# Altium schematic sheet RS485.SchDoc
size A4
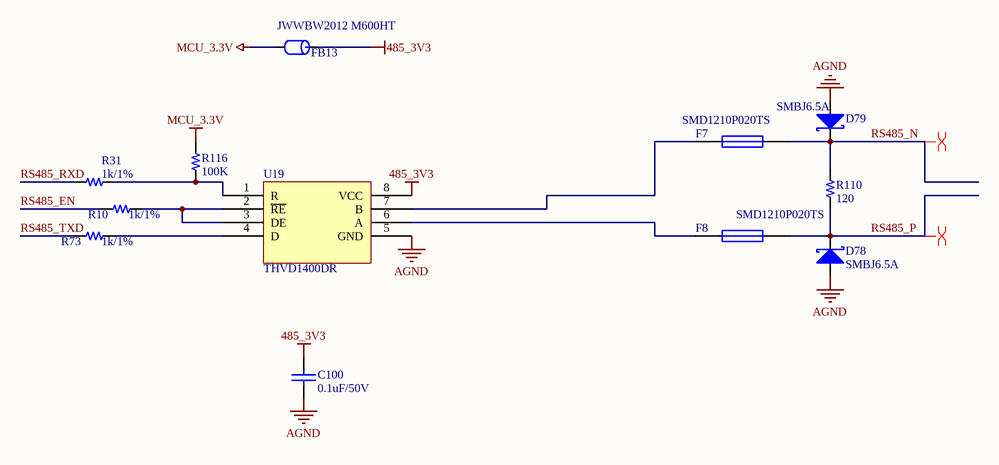
[diagram p0: RS485.SchDoc]

## Parts
C100  0.1uF/50V  [CAPC1608X092N_0603]
D78  SMBJ6.5A  [SMB]
D79  SMBJ6.5A  [SMB]
F7  SMD1210P020TS  [RESC3216X070N_1206]
F8  SMD1210P020TS  [RESC3216X070N_1206]
FB13  JWWBW2012 M600HT  [0805CZ]
R10  1k/1%  [RESC1608X055N_0603]
R31  1k/1%  [RESC1608X055N_0603]
R73  1k/1%  [RESC1608X055N_0603]
R110  120  [RESC1608X055N_0603]
R116  100K  [RESC1608X055N_0603]
U19  THVD1400DR  [so-8]

## Nets
485_3V3: C100.2 FB13.1 U19.8(VCC)
AGND: C100.1 D78.1(A) D79.1(A) U19.5(GND)
MCU_3.3V: FB13.2 R116.2
RS485_EN: R10.2
RS485_N: D79.2(K) F7.2 R110.1
RS485_P: D78.2(K) F8.2 R110.2
RS485_RXD: R31.2
RS485_TXD: R73.2
NetF7_1: F7.1 U19.7(B)
NetF8_1: F8.1 U19.6(A)
NetR10_1: R10.1 U19.2(~{RE}) U19.3(DE)
NetR31_1: R31.1 R116.1 U19.1(R)
NetR73_1: R73.1 U19.4(D)

## Layout directives
differential pair: RS485_N, RS485_P

## Library data of the parts
C100 = CAP: PartNumber: CC0603KRX7R9BB104; Value: 0.1uF/50V; Package: 0603
D78 D79 = DIODE S: Value: SMBJ6.5A; PartNumber: SMBJ6.5A
F7 F8 = Fuse 1: PartNumber: SMD1210-020; Published: 8-Jun-2000; PackageReference: PIN-W2/E2.8; Publisher: Altium Limited; Value: SMD1210P020TS
FB13 = FB: Part Field 1: 磁珠/0603/1K ohm/100MHz; PartNumber: BLM21PG221SN1D; Text Field1: FB; Value: JWWBW2012 M600HT; Package: 0805
R10 R31 R73 = R: PartNumber: RC0603FR-071KL; Value: 1k/1%; Package: 0603
R110 = R: PartNumber: RC0603FR-07120RL; Value: 120; Package: 0603
R116 = R: PartNumber: RC0603FR-07100KL; Value: 100K; Package: 0603
U19 = SN65HVD06D: PartNumber: BL3085; Value: THVD1400DR